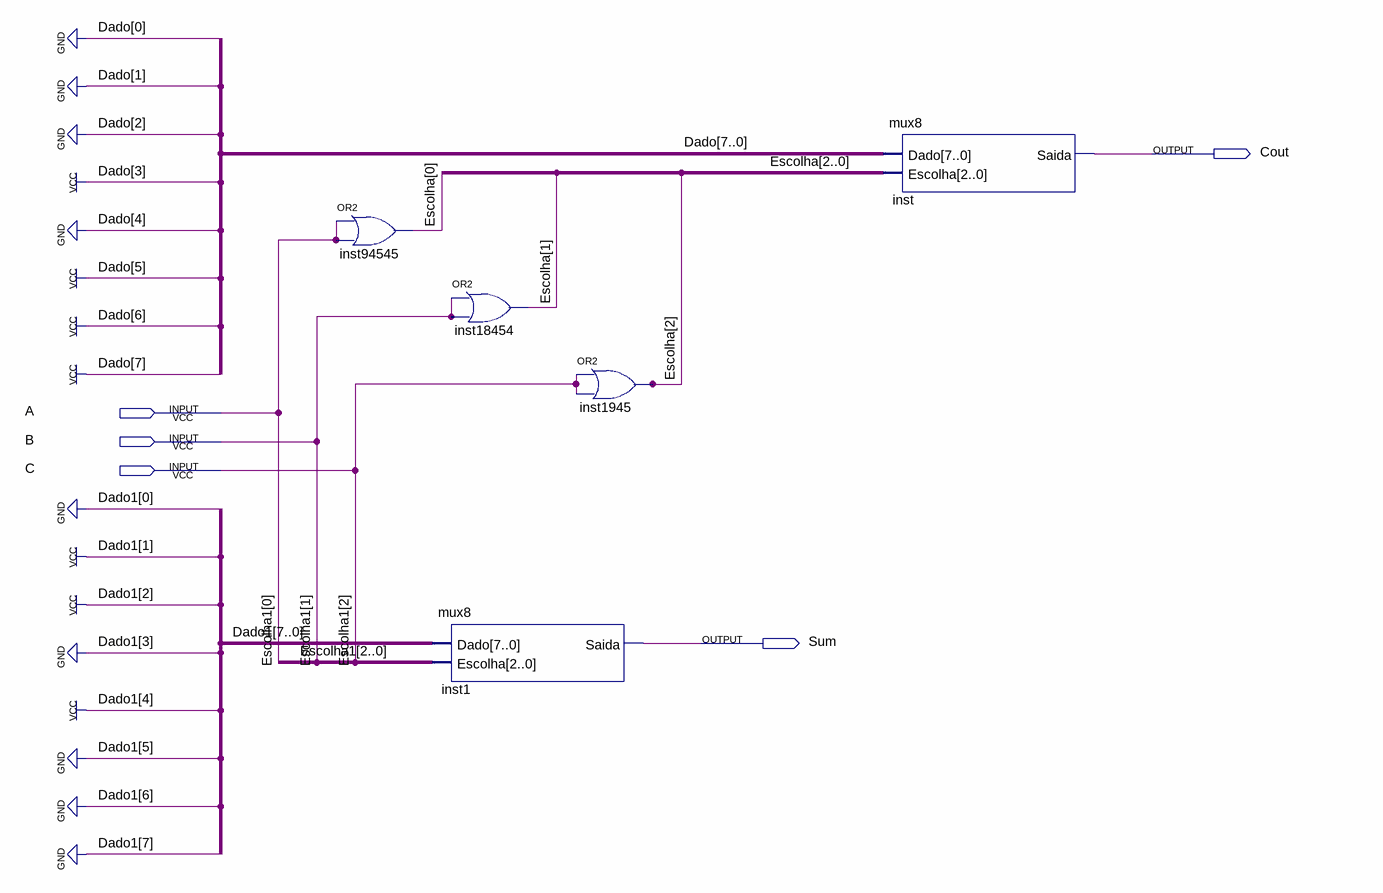
[diagram p0: schematic sheet]
// Quartus schematic fulladd21.bdf as structural Verilog: 5 symbols, 5 pins
module fulladd21 (
  input  A,
  input  B,
  input  C,
  output Cout,
  output Sum
);

  wire [2:0] Escolha;

  or inst94545 (Escolha[0], A, A);
  or inst18454 (Escolha[1], B, B);
  mux8 inst1 (.Dado(8'b00010110), .Escolha({C, B, A}), .Saida(Sum));
  or inst1945 (Escolha[2], C, C);
  mux8 inst (.Dado(8'b11101000), .Escolha(Escolha), .Saida(Cout));

  // Other names for the same wires on the sheet: Escolha1[2:0] = {C, B, A}
endmodule
